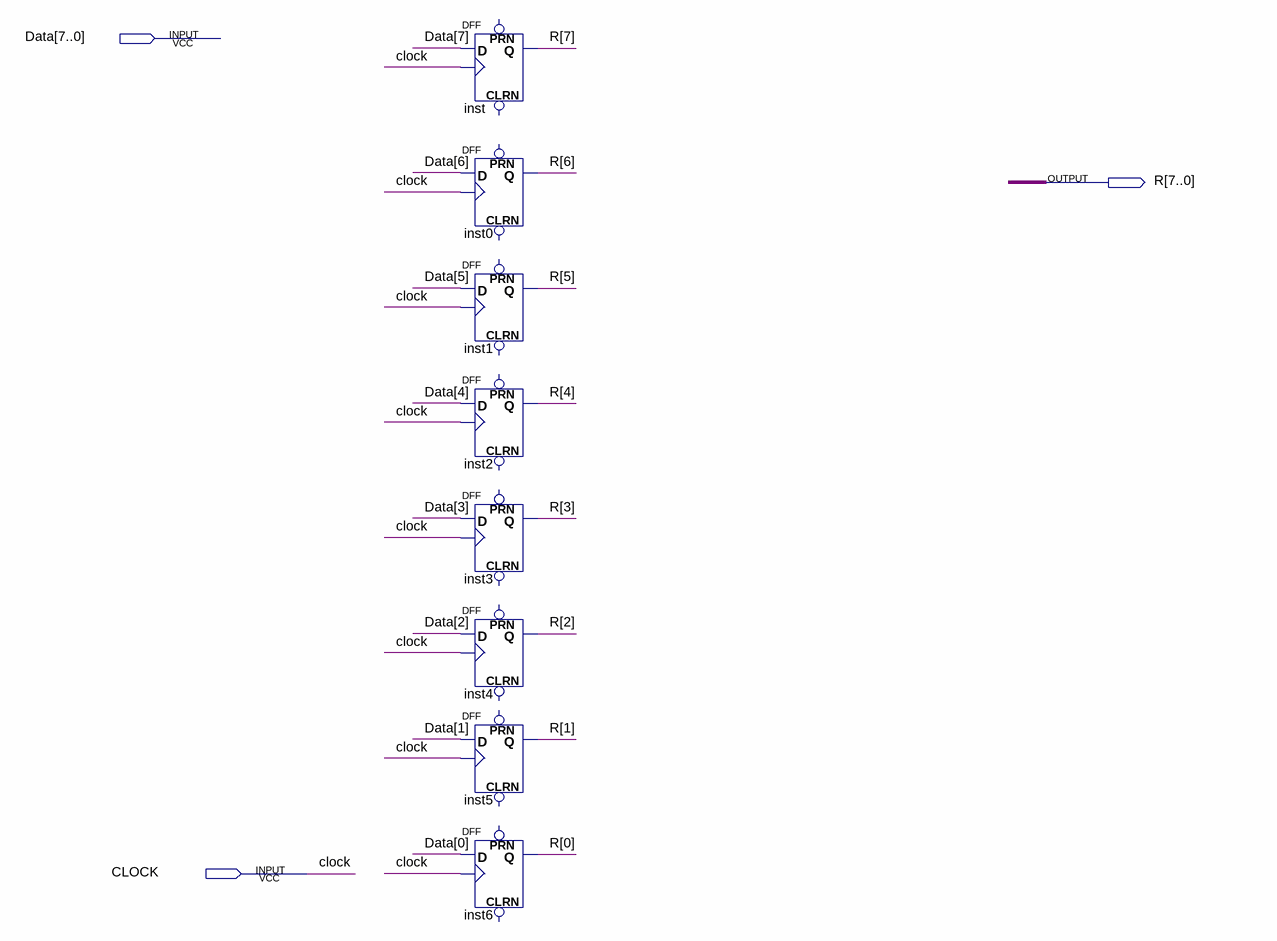
[diagram p0: schematic sheet]
// Quartus schematic ByteRegister.bdf as structural Verilog: 8 symbols, 3 pins
module ByteRegister (
  input  [7:0] Data,
  input  CLOCK,
  output [7:0] R
);

  DFF inst (.CLK(CLOCK), .D(Data[7]), .Q(R[7]));  // open: CLRN, PRN
  DFF inst0 (.CLK(CLOCK), .D(Data[6]), .Q(R[6]));  // open: CLRN, PRN
  DFF inst1 (.CLK(CLOCK), .D(Data[5]), .Q(R[5]));  // open: CLRN, PRN
  DFF inst2 (.CLK(CLOCK), .D(Data[4]), .Q(R[4]));  // open: CLRN, PRN
  DFF inst3 (.CLK(CLOCK), .D(Data[3]), .Q(R[3]));  // open: CLRN, PRN
  DFF inst4 (.CLK(CLOCK), .D(Data[2]), .Q(R[2]));  // open: CLRN, PRN
  DFF inst5 (.CLK(CLOCK), .D(Data[1]), .Q(R[1]));  // open: CLRN, PRN
  DFF inst6 (.CLK(CLOCK), .D(Data[0]), .Q(R[0]));  // open: CLRN, PRN
endmodule
